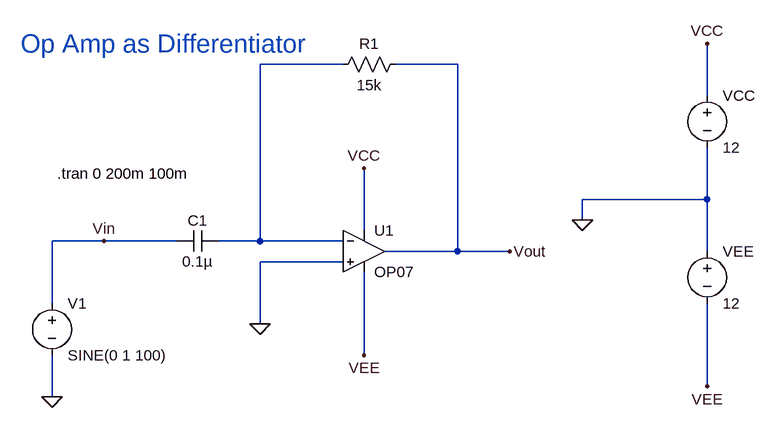
[diagram p0: schematic Op_Amp_Differentiator.asc]
Op_Amp_Differentiator.asc, the LTspice schematic file:
Version 4
SHEET 1 880 680
WIRE 208 80 80 80
WIRE 384 80 288 80
WIRE 768 128 768 48
WIRE 768 288 768 208
WIRE 768 288 576 288
WIRE 576 320 576 288
WIRE 240 336 240 240
WIRE -160 352 -240 352
WIRE -48 352 -160 352
WIRE 80 352 80 80
WIRE 80 352 16 352
WIRE 208 352 80 352
WIRE 384 368 384 80
WIRE 384 368 272 368
WIRE 464 368 384 368
WIRE 768 368 768 288
WIRE 208 384 80 384
WIRE -240 448 -240 352
WIRE 80 480 80 384
WIRE 240 528 240 400
WIRE 768 576 768 448
WIRE -240 592 -240 528
FLAG 576 320 0
FLAG 80 480 0
FLAG -240 592 0
FLAG 240 240 VCC
FLAG 240 528 VEE
FLAG -160 352 Vin
FLAG 768 48 VCC
FLAG 768 576 VEE
FLAG 464 368 Vout
SYMBOL res 304 64 R90
WINDOW 0 0 56 VBottom 2
WINDOW 3 32 56 VTop 2
SYMATTR InstName R1
SYMATTR Value 15k
SYMBOL cap 16 336 R90
WINDOW 0 0 32 VBottom 2
WINDOW 3 32 32 VTop 2
SYMATTR InstName C1
SYMATTR Value 0.1µ
SYMBOL OpAmps\\OP07 240 304 R0
SYMATTR InstName U1
SYMBOL voltage -240 432 R0
WINDOW 123 0 0 Left 0
WINDOW 39 0 0 Left 0
SYMATTR InstName V1
SYMATTR Value SINE(0 1 100)
SYMBOL voltage 768 352 R0
WINDOW 123 0 0 Left 0
WINDOW 39 0 0 Left 0
SYMATTR InstName VEE
SYMATTR Value 12
SYMBOL voltage 768 112 R0
WINDOW 123 0 0 Left 0
WINDOW 39 0 0 Left 0
SYMATTR InstName VCC
SYMATTR Value 12
TEXT -288 48 Left 4 ;Op Amp as Differentiator
TEXT -232 248 Left 2 !.tran 0 200m 100m

The netlist it stands for:
* Op_Amp_Differentiator.asc
R1 Vout N001 15k
C1 N001 Vin 0.1µ
XU1 0 N001 VCC VEE Vout LT1001  ; OP07, pins In+ In- V+ V- OUT
V1 Vin 0 SINE(0 1 100)
VEE 0 VEE 12
VCC VCC 0 12
* Op Amp as Differentiator
.tran 0 200m 100m
.lib LTC.lib
.backanno
.end